# Altium schematic sheet Sheet2.SchDoc
size A4; SheetNumber: 1; SheetTotal: 1
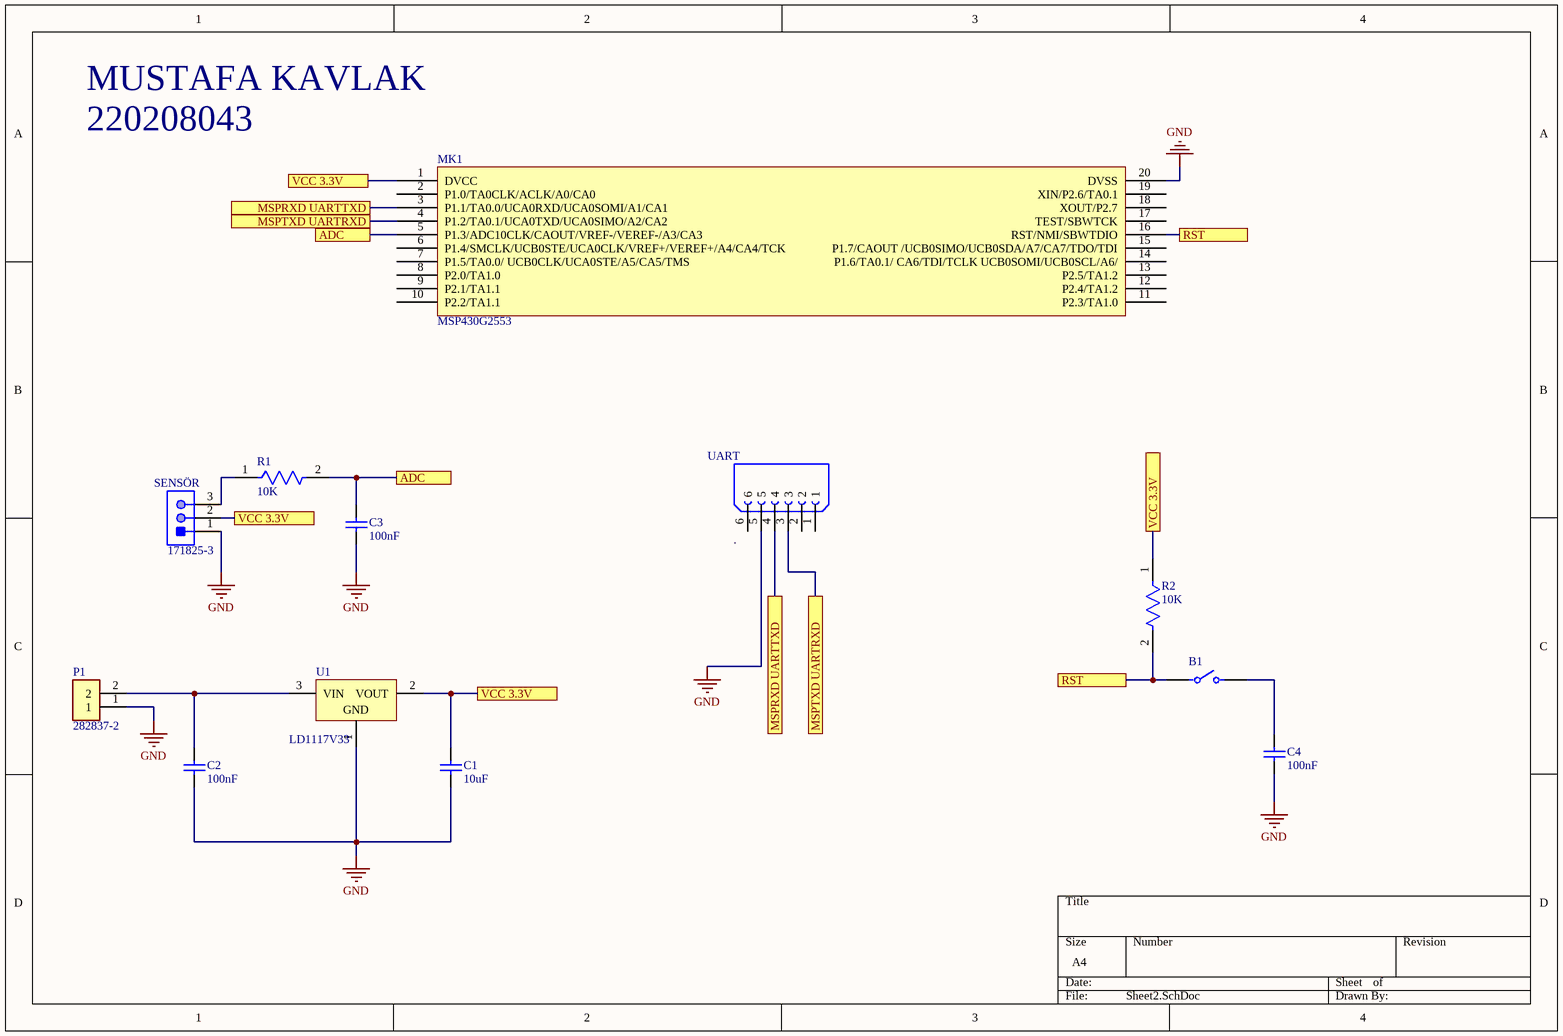
[diagram p0: Sheet2.SchDoc]

## Parts
B1  1  [FP-147873-1-MFG]  (value not drawn)
C1  10uF  [CAPC1210(3225)100_M]
C2  100nF  [CAPC1210(3225)100_M]
C3  100nF  [CAPC1210(3225)100_M]
C4  100nF  [CAPC1210(3225)100_M]
MK1  MSP430G2553  [DIP20]
P1  282837-2  [TE_282837-2]
R1  10K  [FP-CRCW2512-e3-IPC_A]
R2  10K  [FP-CRCW2512-e3-IPC_A]
SENSÖR  171825-3  [TECO-171825-3_V]
U1  LD1117V33  [TO220]
UART  .  [SULLINS_PPTC061LFBN-RC]

## Ports
ADC (see Sheet2[1A]), ADC (see Sheet2[2B]), MSPRXD UARTTXD (see Sheet2[1A]), MSPRXD UARTTXD (see Sheet2[2C]), MSPTXD UARTRXD (see Sheet2[1A]), MSPTXD UARTRXD (see Sheet2[3C]), RST (see Sheet2[3C]), RST (see Sheet2[4A]), VCC 3.3V (see Sheet2[1A], Sheet2[1C], Sheet2[2C]), VCC 3.3V (see Sheet2[1A], Sheet2[1C], Sheet2[3C]), VCC 3.3V (see Sheet2[1A], Sheet2[2C], Sheet2[3C]), VCC 3.3V (see Sheet2[1C], Sheet2[2C], Sheet2[3C])

## Nets
GND: C1.1 C2.1 C3.1 C4.1 MK1.20(DVSS) P1.1 SENSÖR.1 U1.1(GND) UART.5
ADC: C3.2 MK1.5(P1.3/ADC10CLK/CAOUT/VREF-/VEREF-/A3/CA3) R1.2 ; port ADC
MSPRXD UARTTXD: MK1.3(P1.1/TA0.0/UCA0RXD/UCA0SOMI/A1/CA1) UART.4 ; port MSPRXD UARTTXD
MSPTXD UARTRXD: MK1.4(P1.2/TA0.1/UCA0TXD/UCA0SIMO/A2/CA2) UART.3 ; port MSPTXD UARTRXD
RST: B1.1 MK1.16(RST/NMI/SBWTDIO) R2.2 ; port RST
VCC 3.3V: C1.2 MK1.1(DVCC) R2.1 SENSÖR.2 U1.2(VOUT) ; port VCC 3.3V
NetB1_2: B1.2 C4.2
NetC2_2: C2.2 P1.2 U1.3(VIN)
NetR1_1: R1.1 SENSÖR.3

Not connected (* = marked no-connect by the designer): MK1 2(P1.0/TA0CLK/ACLK/A0/CA0) 6(P1.4/SMCLK/UCB0STE/UCA0CLK/VREF+/VEREF+/A4/CA4/TCK) 7(P1.5/TA0.0/_UCB0CLK/UCA0STE/A5/CA5/TMS_) 8(P2.0/TA1.0) 9(P2.1/TA1.1) 10(P2.2/TA1.1) 11(P2.3/TA1.0) 12(P2.4/TA1.2) 13(P2.5/TA1.2) 14(P1.6/TA0.1/_CA6/TDI/TCLK_UCB0SOMI/UCB0SCL/A6/) 15(P1.7/CAOUT_/UCB0SIMO/UCB0SDA/A7/CA7/TDO/TDI) 17(TEST/SBWTCK) 18(XOUT/P2.7) 19(XIN/P2.6/TA0.1); UART 1 2 6

## Notes on the sheet
- MUSTAFA KAVLAK
- 220208043

## Library data of the parts
B1 = CMP-03407-000005-1: SWITCH TACTILE SPST-NO 0.05A 24V; Manufacturer: TE Connectivity; Manufacturer Part Number: 147873-1; Contact Resistance: 100mΩ; Operating Force: 180gf; Electromechanical Life: 40000Cycles; Contact Current Rating: 50mA; Throw Configuration: SPST-NO; Mouser Description: Switch Tactile OFF (ON) SPST Rectangular Button J-Bend 0.05A 24VDC 1.77N SMD T/R; Mount: Surface Mount; Height: 5.5mm; Category: Switch; RoHS: TRUE; Temperature Range High: +85°C; ComponentLink2Description: Datasheet; Temperature Range Low: -35°C; Device Class L1: Electromechanical; Device Class L2: Switches; Package: 0; Temperature: -35°C to +85°C; Device Class L3: Tactile Switches; Automotive: No; ComponentLink2URL: https://www.te.com/commerce/DocumentDelivery/DDEController?Action=showdoc&DocId=Customer+Drawing%7F147873%7FK3%7Fpdf%7FEnglish%7FENG_CD_147873_K3.pdf%7F147873-1; Lead Free: Yes; Voltage Rating Dc: 24V; Octopart: https://octopart.com/147873-1-te+connectivity-40818451; Digikey Description: SWITCH TACTILE SPST-NO 0.05A 24V
C1-C4 = CMP-1038-01141-1: CAP 10nF 250V ±5% 1210 (3225 Metric) Thickness 1mm SMD; Case-EIA: 1210; Tolerance: Â±5%; Case-Metric: 3225; Technology: SMT; Max Thickness: 1 mm; Value: 10nF; Rated Voltage: 250 V
P1 = 282837-2: Ð Ð°Ð·ÑŠÐµÐ¼Ð½Ñ‹Ðµ ÐºÐ»ÐµÐ¼Ð¼Ð½Ñ‹Ðµ ÐºÐ¾Ð»Ð¾Ð´ÐºÐ¸ Ð Ð¾Ð·ÐµÑ‚ÐºÐ° 2 Ð¿Ð¾Ð»Ð¾Ð¶ÐµÐ½Ð¸Ñ 5,08 Ð¼Ð¼ ÐŸÑ€Ð¸Ð¿Ð¾Ð¹ Ð¿Ñ€ÑÐ¼Ð¾Ð¹ Ñ‡ÐµÑ€ÐµÐ· Ð¾Ñ‚Ð²ÐµÑ€ÑÑ‚Ð¸Ðµ 13,5 Ð / ÐºÐ¾Ð½Ñ‚Ð°ÐºÑ‚; MF: TE Connectivity; SnapEDA_Link: https://www.snapeda.com/parts/282837-2/TE+Connectivity+AMP+Connectors/view-part/?ref=snap; Price: None; Check_prices: https://www.snapeda.com/parts/282837-2/TE+Connectivity+AMP+Connectors/view-part/?ref=eda; Purchase-URL: https://pricing.snapeda.com/search/part/282837-2/?ref=eda; MP: 282837-2; Value: *; Availability: In Stock; Package: None
R1 R2 = CMP-02407-002758-1: RES Thick Film, 10kΩ, 5%, 1W, 200ppm/°C, 2512; Resistance: 10kR; Voltage Rating: 500V; Termination: SMD/SMT; Weight: 0.001429oz; Number of Terminations: 2; Package Quantity: 1; Case/Package: 2512; Length: 6.3mm; Temperature Coefficient: 200ppm/°C; Packaging: Tape and Reel; Voltage Rating (DC): 500V; Case Code (Imperial): 2512; Max Operating Temperature: 155°C; Number of Pins: 2; Height: 0.028inch; Military Standard: Not; Lead Free: Lead Free; Min Operating Temperature: -55°C; Features: Automotive AEC-Q200; Contact Plating: Tin; Depth: 3.15mm; Mount: Surface Mount; REACH SVHC: No SVHC; Composition: Thick Film; Radiation Hardening: No; Max Power Dissipation: 1W; Case Code (Metric): 6432; Power Rating: 1W; Width: 0.124inch; Tolerance: 5%
SENSÖR = CMP-2000-07494-1: Male Header, Pitch 2.5 mm, 1 x 3 Position, Height 10.4 mm, Tail Length 3.6 mm, / -20 to 95 degC / , RoHS, Bulk; Manufacturer: TE Connectivity; Mating Alignment: Yes(With); Tail Length: 0.142inch; Mating Post Length: 7.5mm; PCB Thickness: 0.063inch; PCB Mount Alignment: No(Without); Voltage Rating: 350V; Max Voltage Rating (AC): 250V; Plating Thickness: 0.8um; PCB Mounting Orientation: Vertical; Number of Positions: 3; PCB Mount Retention: Without; Max Current Rating: 3.5A; Max Voltage Rating (DC): 350.25kV; Pitch: 2.5mm; Approvals: UL; Contact Resistance: 20mOhm; Mount: ThroughHole; Length: 7.5mm; Orientation: Straight; Contact Mating Length: 0.295inch; Contact Material: Brass; Housing Material: Nylon; Package Description: Male Header, Pitch 2.5 mm, 1 x 3 Position, Height 10.4 mm, Tail Length 3.6 mm; Colour: Natural; Backwall/Post Interruptions: No(Without); Min Operating Temperature: -20degC; Mating Retention: Yes(With); Connector Type: Header; Packaging: Bag; RoHSCompliant: True; Package Reference: 171825-3; Contact Shape: Square; Strain Relief: No(Without); Contact Gender: Male; Number of Contacts: 3; Manufacturer URL: http://www.te.com/; Height: 0.409inch; Contact Retention: No(Without); Datasheet Version: Rev. Y3, 12/2016; Panel Mount Retention: No(Without); Datasheet URL: http://www.te.com/commerce/DocumentDelivery/DDEController?Action=showdoc&DocId=Customer+Drawing%7F171825%7FY3%7Fpdf%7FEnglish%7FENG_CD_171825_Y3.pdf%7F171825-3; Termination: Solder; Mounting Technology: ThroughHole; Max Operating Temperature: 95degC; Flammability Rating: UL94V-0; REACH SVHC: NoSVHC; Housing Colour: Natural; Package Quantity: 1000; Number of Rows: 1; Depth: 4.9mm; Contact Plating: Tin
U1 = CMP-0244-00470-1: Fixed Low Drop Positive Voltage Regulator, 3.3V, 3-Pin TO-220; PackageVersion: ver3.0; PackageDescription: TO, Thru-Hole, Vertical, Heatsink Mounted; 3 In-Line Leads; Pitch 2.54 mm; ComponentLink1Description: Manufacturer URL; ComponentLink3URL: http://www.st.com/internet/com/TECHNICAL_RESOURCES/TECHNICAL_LITERATURE/PACKAGE_INFORMATION/CD00004649.pdf; PackageReference: TO220; ComponentLink2URL: http://www.st.com/internet/com/TECHNICAL_RESOURCES/TECHNICAL_LITERATURE/DATASHEET/CD00000544.pdf; ComponentLink3Description: Package Specification; ComponentLink2Description: Datasheet; ComponentLink1URL: http://www.st.com; DatasheetVersion: 1/11/2011
UART = PPTC061LFBN-RC: MF: {'manufacturer': u'Sullins Connector Solutions'}; Package: None; Price: None; Value: *; MP: PPTC061LFBN-RC; Availability: Unavailable